# Altium project AUPSC.PrjPcb
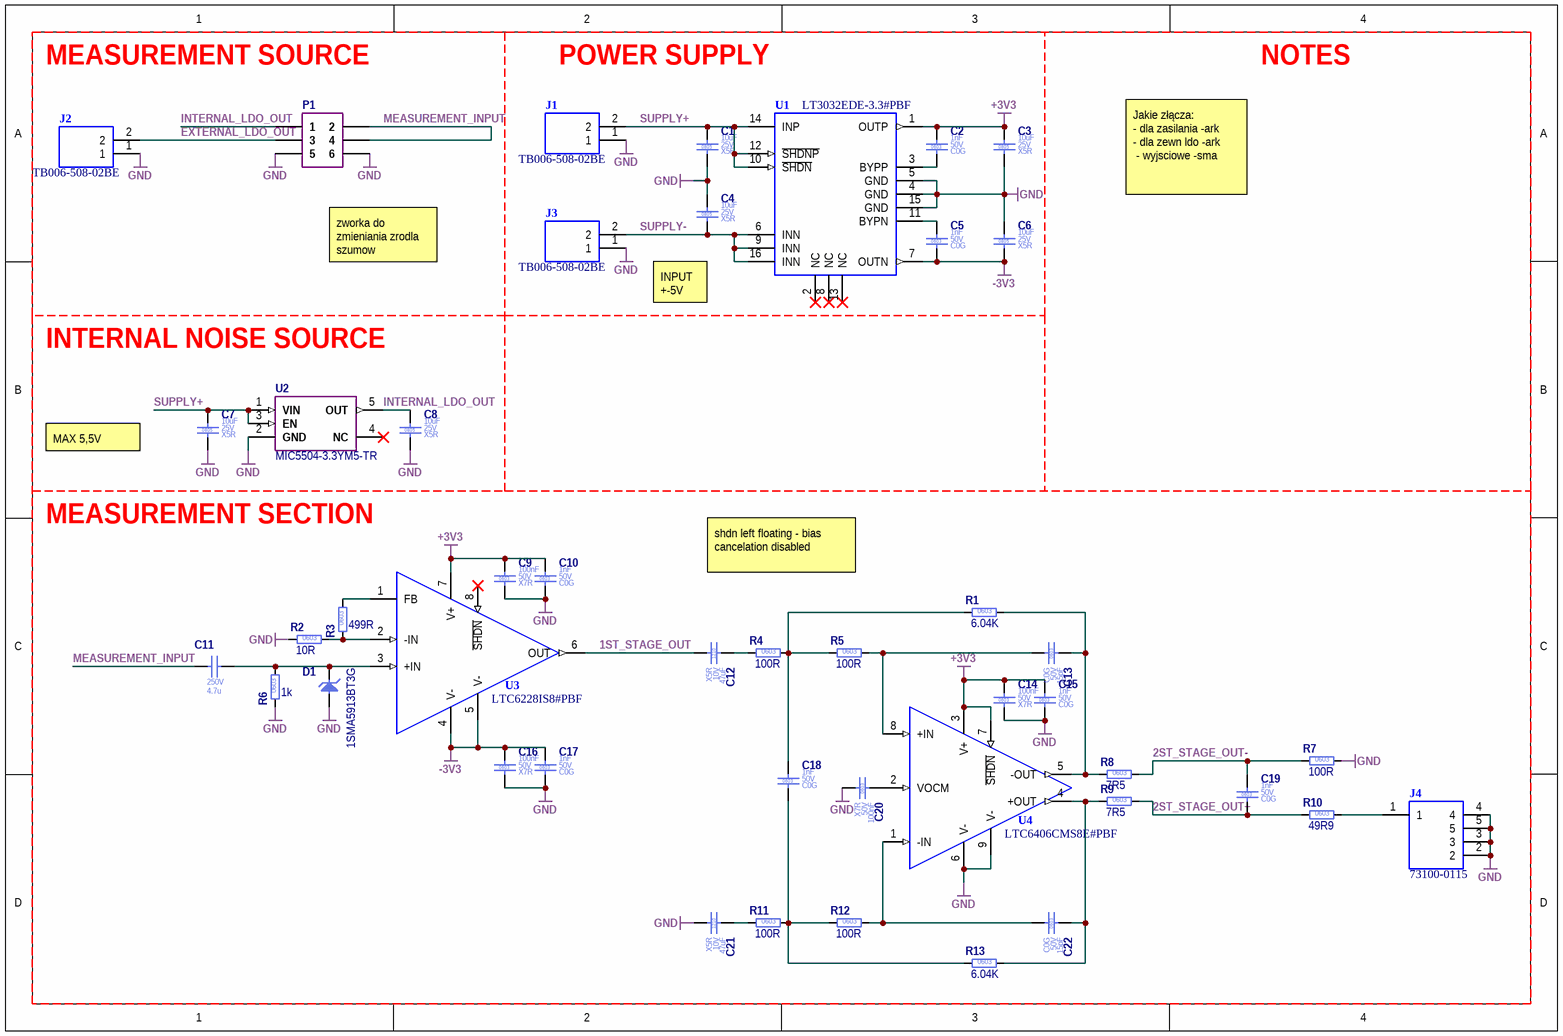
[diagram p0: main.SchDoc]
1 sheet, 45 parts. Net scope: global (net labels, ports and power ports of the same name join across sheets).
Board file: main.PcbDoc

## Sheet main.SchDoc
size A4; Revision: Rev 0

### Parts
C1  Case/Package: 0805  Voltage Rating (DC): 25V  Dielectric: X5R  Capacitance: 10uF  [C_0805_2012]  (hidden comment: C_10UF_25V_X5R_0805_20)
C2  Case/Package: 0603  Voltage Rating (DC): 50V  Dielectric: C0G  Capacitance: 1nF  [C_0603_1608]  (hidden comment: C_1NF_50V_C0G_0603_5)
C3  Case/Package: 0805  Voltage Rating (DC): 25V  Dielectric: X5R  Capacitance: 10uF  [C_0805_2012]  (hidden comment: C_10UF_25V_X5R_0805_20)
C4  Case/Package: 0805  Voltage Rating (DC): 25V  Dielectric: X5R  Capacitance: 10uF  [C_0805_2012]  (hidden comment: C_10UF_25V_X5R_0805_20)
C5  Case/Package: 0603  Voltage Rating (DC): 50V  Dielectric: C0G  Capacitance: 1nF  [C_0603_1608]  (hidden comment: C_1NF_50V_C0G_0603_5)
C6  Case/Package: 0805  Voltage Rating (DC): 25V  Dielectric: X5R  Capacitance: 10uF  [C_0805_2012]  (hidden comment: C_10UF_25V_X5R_0805_20)
C7  Case/Package: 0805  Voltage Rating (DC): 25V  Dielectric: X5R  Capacitance: 10uF  [C_0805_2012]  (hidden comment: C_10UF_25V_X5R_0805_20)
C8  Case/Package: 0805  Voltage Rating (DC): 25V  Dielectric: X5R  Capacitance: 10uF  [C_0805_2012]  (hidden comment: C_10UF_25V_X5R_0805_20)
C9  Case/Package: 0603  Voltage Rating (DC): 50V  Dielectric: X7R  Capacitance: 100nF  [C_0603_1608]  (hidden comment: C_100NF_50V_X7R_0603_5)
C10  Case/Package: 0603  Voltage Rating (DC): 50V  Dielectric: C0G  Capacitance: 1nF  [C_0603_1608]  (hidden comment: C_1NF_50V_C0G_0603_5)
C11  Voltage Rating (DC): 250V  Capacitance: 4.7u  [CP_22.5mm_tht]  (hidden comment: C)
C12  Case/Package: 1210  Voltage Rating (DC): 10V  Dielectric: X5R  Capacitance: 47uF  [C_1210_3225]  (hidden comment: C_47UF_10V_X5R_1210_10)
C13  Case/Package: 0603  Voltage Rating (DC): 50V  Dielectric: C0G  Capacitance: 15pF  [C_0603_1608]  (hidden comment: C_15PF_50V_C0G_0603_5)
C14  Case/Package: 0603  Voltage Rating (DC): 50V  Dielectric: X7R  Capacitance: 100nF  [C_0603_1608]  (hidden comment: C_100NF_50V_X7R_0603_5)
C15  Case/Package: 0603  Voltage Rating (DC): 50V  Dielectric: C0G  Capacitance: 1nF  [C_0603_1608]  (hidden comment: C_1NF_50V_C0G_0603_5)
C16  Case/Package: 0603  Voltage Rating (DC): 50V  Dielectric: X7R  Capacitance: 100nF  [C_0603_1608]  (hidden comment: C_100NF_50V_X7R_0603_5)
C17  Case/Package: 0603  Voltage Rating (DC): 50V  Dielectric: C0G  Capacitance: 1nF  [C_0603_1608]  (hidden comment: C_1NF_50V_C0G_0603_5)
C18  Case/Package: 0603  Voltage Rating (DC): 50V  Dielectric: C0G  Capacitance: 1nF  [C_0603_1608]  (hidden comment: C_1NF_50V_C0G_0603_5)
C19  Case/Package: 0603  Voltage Rating (DC): 50V  Dielectric: C0G  Capacitance: 1nF  [C_0603_1608]  (hidden comment: C_1NF_50V_C0G_0603_5)
C20  Case/Package: 0603  Voltage Rating (DC): 50V  Dielectric: X7R  Capacitance: 100nF  [C_0603_1608]  (hidden comment: C_100NF_50V_X7R_0603_5)
C21  Case/Package: 1210  Voltage Rating (DC): 10V  Dielectric: X5R  Capacitance: 47uF  [C_1210_3225]  (hidden comment: C_47UF_10V_X5R_1210_10)
C22  Case/Package: 0603  Voltage Rating (DC): 50V  Dielectric: C0G  Capacitance: 15pF  [C_0603_1608]  (hidden comment: C_15PF_50V_C0G_0603_5)
D1  1SMA5913BT3G  [SMA-2]
J1  TB006-508-02BE  [TB00650802BE]
J2  TB006-508-02BE  [TB00650802BE]
J3  TB006-508-02BE  [TB00650802BE]
J4  73100-0115  [731000115]
P1  826925-3  [HEADER_M_2x3_2.54]  (value not drawn)
R1  Resistance: 6.04K  Case/Package: 0603  [R_0603_1608]  (hidden comment: R_6K04_0603_1)
R2  Resistance: 10R  Case/Package: 0603  [R_0603_1608]  (hidden comment: R_10R_0603_1)
R3  Resistance: 499R  Case/Package: 0603  [R_0603_1608]  (hidden comment: R_499R_0603_1)
R4  Resistance: 100R  Case/Package: 0603  [R_0603_1608]  (hidden comment: R_100R_0603_1)
R5  Resistance: 100R  Case/Package: 0603  [R_0603_1608]  (hidden comment: R_100R_0603_1)
R6  Resistance: 1k  Case/Package: 0603  [R_0603_1608]  (hidden comment: R_1K_0603_1)
R7  Resistance: 100R  Case/Package: 0603  [R_0603_1608]  (hidden comment: R_100R_0603_1)
R8  Resistance: 7R5  Case/Package: 0603  [R_0603_1608]  (hidden comment: R_7R5_0603_1)
R9  Resistance: 7R5  Case/Package: 0603  [R_0603_1608]  (hidden comment: R_7R5_0603_1)
R10  Resistance: 49R9  Case/Package: 0603  [R_0603_1608]  (hidden comment: R_49R9_0603_1)
R11  Resistance: 100R  Case/Package: 0603  [R_0603_1608]  (hidden comment: R_100R_0603_1)
R12  Resistance: 100R  Case/Package: 0603  [R_0603_1608]  (hidden comment: R_100R_0603_1)
R13  Resistance: 6.04K  Case/Package: 0603  [R_0603_1608]  (hidden comment: R_6K04_0603_1)
U1  LT3032EDE-3.3#PBF  [LT3032EDE5PBF]
U2  MIC5504-3.3YM5-TR  [SOT23-5_SC74A_SOT753_M]
U3  LTC6228IS8#PBF  [SOIC127P599X175-8N]
U4  LTC6406CMS8E#PBF  [SOP65P490X110-9N]

### Blocks framed on the sheet
INTERNAL NOISE SOURCE: C7 C8 U2

### Nets
+3V3: C2.1 C3.1 C9.1 C10.1 C14.1 C15.1 U1.1(OUTP) U3.7(V+) U4.3(V+) U4.7(~{SHDN})
-3V3: C5.2 C6.2 C16.1 C17.1 U1.7(OUTN) U3.4(V-) U3.5(V-)
GND: C1.2 C3.2 C4.1 C6.1 C7.2 C8.2 C9.2 C10.2 C14.2 C15.2 C16.2 C17.2 C20.2 C21.2 D1.1(A) J1.1 J2.1 J3.1 J4.2 J4.3 J4.4 J4.5 P1.5 P1.6 R2.1 R6.1 R7.2 U1.4(GND) U1.5(GND) U1.15(GND) U2.2(GND) U4.6(V-) U4.9(V-)
1ST_STAGE_OUT: C12.2 U3.6(OUT)
2ST_STAGE_OUT+: C19.2 R9.2 R10.1
2ST_STAGE_OUT-: C19.1 R7.1 R8.2
EXTERNAL_LDO_OUT: J2.2 P1.3
INTERNAL_LDO_OUT: C8.1 P1.1 U2.5(OUT)
MEASUREMENT_INPUT: C11.2 P1.2 P1.4
SUPPLY+: C1.1 C7.1 J1.2 U1.10(~{SHDN}) U1.12(~{SHDNP}) U1.14(INP) U2.1(VIN) U2.3(EN)
SUPPLY-: C4.2 J3.2 U1.6(INN) U1.9(INN) U1.16(INN)
NetC2_2: C2.2 U1.3(BYPP)
NetC5_1: C5.1 U1.11(BYPN)
NetC11_1: C11.1 D1.2(C) R6.2 U3.3(+IN)
NetC12_1: C12.1 R4.1
NetC13_1: C13.1 R1.2 R8.1 U4.5(-OUT)
NetC13_2: C13.2 R5.2 U4.8(+IN)
NetC18_1: C18.1 R1.1 R4.2 R5.1
NetC18_2: C18.2 R11.2 R12.1 R13.1
NetC20_1: C20.1 U4.2(VOCM)
NetC21_1: C21.1 R11.1
NetC22_1: C22.1 R9.1 R13.2 U4.4(+OUT)
NetC22_2: C22.2 R12.2 U4.1(-IN)
NetJ4_1: J4.1 R10.2
NetR2_2: R2.2 R3.1 U3.2(-IN)
NetR3_2: R3.2 U3.1(FB)

Not connected (* = marked no-connect by the designer): U1 2(NC)* 8(NC)* 13(NC)*; U2 4(NC)*; U3 8(~{SHDN})*

### Notes on the sheet
- MEASUREMENT SOURCE
- POWER SUPPLY
- NOTES
- Jakie złącza:
  - dla zasilania -ark
  - dla zewn ldo -ark
  - wyjsciowe -sma
- zworka do zmieniania zrodla szumow
- INPUT +-5V
- MAX 5,5V
- MEASUREMENT SECTION
- shdn left floating - bias cancelation disabled
- Title
- Size:
- Date:
- A4

### Library data of the parts
C1 C3 C4 C6-C8 = C_10UF_25V_X5R_0805_20: Ceramic Capacitor; Manufacturer Part Number: TMK212BBJ106MG-T; Manufacturer: Taiyo Yuden; Tolerance: 20%; Part Number: C_10UF_25V_X5R_0805_20; Mount: Surface Mount; Height: 1.25mm; HelpURL: https://pl.mouser.com/datasheet/2/396/mlcc02_e-1307760.pdf; RoHS: Compliant; Max Operating Temperature: 85; Status: MK; Supplier 1: Mouser; Supplier Part Number 1: 963-TMK212BBJ106MG-T
C2 C5 C10 C15 C17-C19 = C_1NF_50V_C0G_0603_5: Ceramic Capacitor; Tolerance: 10%; Part Number: C_1NF_50V_C0G_0603_5; Mount: Surface Mount; Height: 0mm
C9 C14 C16 C20 = C_100NF_50V_X7R_0603_5: Ceramic Capacitor; Manufacturer Part Number: CC0603JRX7R9BB104; Manufacturer: Yageo; Tolerance: 5%; Part Number: C_100NF_50V_X7R_0603_5; Mount: Surface Mount; Height: 0mm; HelpURL: http://datasheet.octopart.com/CC0603JRX7R9BB104-Yageo-datasheet-10883670.pdf; Max Operating Temperature: 125
C11 = CP_4U7_250V_22.5mm_10: Film Capacitors 250VDC 4.7uF 10% MPET L/S=22.5mm
C12 C21 = C_47UF_10V_X5R_1210_10: Ceramic Capacitor; Tolerance: 10%; Part Number: C_47UF_10V_X5R_1210_10; Mount: Surface Mount; Height: 2.5mm; Max Operating Temperature: 85
C13 C22 = C_15PF_50V_C0G_0603_5: Ceramic Capacitor; Tolerance: 10%; Part Number: C_15PF_50V_C0G_0603_5; Mount: Surface Mount; Height: 0mm
D1 = 1SMA5913BT3G: Zener Diodes 3.3V 1.5W
J1-J3 = TB006-508-02BE: Fixed Terminal Blocks Terminal block, screw type, 5.08 , horizontal, 2 poles, CUI Blue, slotted screw, PCB mount; Manufacturer_Name: CUI Devices; Datasheet Link: https://www.mouser.com/datasheet/2/670/tb006-508-1550645.pdf; Height: 10.4mm; Manufacturer_Part_Number: TB006-508-02BE; Arrow Part Number: TB006-508-02BE; Arrow Price/Stock: https://www.arrow.com/en/products/tb006-508-02be/cui-devices; Mouser Part Number: 490-TB006-508-02BE; Mouser Price/Stock: https://www.mouser.co.uk/ProductDetail/CUI-Devices/TB006-508-02BE?qs=vLWxofP3U2wEdOVV%2FaT04w%3D%3D
J4 = 73100-0115: SMA right angle connector female; Manufacturer_Name: Molex; Datasheet Link: https://www.molex.com/pdm_docs/sd/731000115_sd.pdf; Height: 9.57mm; Manufacturer_Part_Number: 73100-0115; Mouser Part Number: 538-73100-0115; Mouser Price/Stock: https://www.mouser.co.uk/ProductDetail/Molex/73100-0115?qs=dxVETAvtHz69wpck%252B7ItSw%3D%3D
P1 = 826925-3: Header, 3-Pin, Dual row; Manufacturer: TE Connectivity; Gender: Male; Pitch: 2.54mm; Part Number: 826925-3; Manufacturer Part Number: 826925-3; Mount: Through Hole; Number of Rows: 2; Orientation: Straight; HelpURL: https://octopart.com/datasheet/826925-3-te+connectivity-41192668; Max Operating Temperature: 0°C; Number of Pins: 6
R1 R13 = R_6K04_0603_1: Thin Film Resistor; Manufacturer: Yageo; Manufacturer Part Number: RT0603FRE076K04L; Tolerance: 1%; Voltage Rating (DC): 50V; Power Rating: 100mW; Stats: MK; Part Number: R_6K04_0603_1; Mount: Surface Mount; Height: 0.3mm; HelpURL: https://pl.mouser.com/datasheet/2/447/PYu-RT_1-to-0.01_RoHS_L_11-1669912.pdf; RoHS: Compliant; Max Operating Temperature: 155; Supplier 1: Mouser; Supplier Part Number 1: 603-RT0402BRD076K04L; Stock: 0
R2 = R_10R_0603_1: Tolerance: 1%; Voltage Rating (DC): 50V; Power Rating: 100mW; Part Number: R_10R_0603_1; Mount: Surface Mount; Height: 0.45mm; Max Operating Temperature: 155°C
R3 = R_499R_0603_1: Thin Film Resistors; Manufacturer: Yageo; Manufacturer Part Number: RT0603FRE07499RL; Tolerance: 1%; Voltage Rating (DC): 50V; Power Rating: 100mW; Stats: MK; Part Number: R_499R_0603_1; Mount: Surface Mount; Height: 0.45mm; HelpURL: https://pl.mouser.com/datasheet/2/447/PYu-RT_1-to-0.01_RoHS_L_11-1669912.pdf; RoHS: Compliant; Max Operating Temperature: 155; Supplier 1: Mouser; Supplier Part Number 1: 603-RT0402BRD07499RL
R4 R5 R7 R11 R12 = R_100R_0603_1: Tolerance: 1%; Voltage Rating (DC): 50V; Power Rating: 125mW; Part Number: R_100R_0603_1; Mount: Surface Mount; Height: 0.45mm; Max Operating Temperature: 0°C
R6 = R_1K_0603_1: Tolerance: 1%; Power Rating: 100mW; Part Number: R_1K_0603_1; Mount: Surface Mount; Height: 0.45mm; Max Operating Temperature: 0°C
R8 R9 = R_7R5_0603_1: Thin Film Resistor; Manufacturer: Yageo; Manufacturer Part Number: RT0603FRE077R5L; Tolerance: 1%; Voltage Rating (DC): 50V; Power Rating: 100mW; Stats: MK; Part Number: R_7R5_0603_1; Mount: Surface Mount; Height: 0.45mm; HelpURL: https://pl.mouser.com/datasheet/2/447/PYu-RC_Group_51_RoHS_L_10-1664068.pdf; RoHS: Compliant; Max Operating Temperature: 155°C; Supplier 1: Mouser; Supplier Part Number 1: 603-RT0603FRE077R5L
R10 = R_49R9_0603_1: Thin Film Resistors; Manufacturer: Yageo; Manufacturer Part Number: RT0603FRE0749R9L; Tolerance: 1%; Voltage Rating (DC): 50V; Power Rating: 100mW; Stats: MK; Part Number: R_49R9_0603_1; Mount: Surface Mount; Height: 0.45mm; HelpURL: https://pl.mouser.com/datasheet/2/447/PYu-RT_1-to-0.01_RoHS_L_11-1669912.pdf; RoHS: Compliant; Max Operating Temperature: 155°C; Supplier 1: Mouser; Supplier Part Number 1: 603-RT0603FRE0749R9L
U1 = LT3032EDE-5#PBF: LDO Voltage Regulators Dual 200mA Positive/Negative, Low Noise, Low Dropout Linear Regulator / RoHS Compliant; Manufacturer_Name: Analog Devices; Datasheet Link: https://www.arrow.com/en/products/lt3032ede-5pbf/analog-devices; Height: 0.8mm; Manufacturer_Part_Number: LT3032EDE-3.3#PBF; Arrow Part Number: LT3032EDE-3.3#PBF; Arrow Price/Stock: https://www.arrow.com/en/products/lt3032ede-5pbf/analog-devices; Mouser Part Number: 584-LT3032EDE-3.3PBF; Mouser Price/Stock: https://www.mouser.co.uk/ProductDetail/Analog-Devices/LT3032EDE-5PBF?qs=ytflclh7QUXSJKCH531bKg%3D%3D
U2 = MIC5504-3.3YM5-TR: LDO Voltage Regulators Single 300mA LDO; Manufacturer: Microchip; Max Power Dissipation: 660mW; Nominal Output Voltage: 3.3V; Polarity: Positive; Output Type: Fixed; Accuracy: 0,02; Dropout Voltage: 160mV; Max Input Voltage: 5.5V; Min Input Voltage: 3.7V; Min Output Voltage: 3.2V; Quiescent Current: 38µA; Manufacturer Part Number: MIC5504-3.3YM5-TR; Part Number: MIC5504-3.3YM5-TR; Max Output Current: 300mA; Mount: Surface Mount; Case/Package: SOT23-5; Height: 1.45mm; HelpURL: https://pl.mouser.com/datasheet/2/268/MIC550X-1082389.pdf; Max Operating Temperature: 125°C; Max Output Voltage: 3.3V; Number of Pins: 5; RoHS: Compliant; Status: TC; Supplier 1: Mouser; Supplier Part Number 1: 998-MIC5504-3.3YM5TR
U3 = LTC6228IS8#PBF: High Speed Operational Amplifiers Precision Low Drift & Noise HiSpeed; Manufacturer_Name: Analog Devices; Datasheet Link: https://www.analog.com/media/en/technical-documentation/data-sheets/LTC6228-6229.pdf; Height: 1.752mm; Manufacturer_Part_Number: LTC6228IS8#PBF; Arrow Part Number: LTC6228IS8#PBF; Arrow Price/Stock: https://www.arrow.com/en/products/ltc6228is8pbf/analog-devices; Mouser Part Number: 584-LTC6228IS8#PBF; Mouser Price/Stock: https://www.mouser.co.uk/ProductDetail/Analog-Devices/LTC6228IS8PBF?qs=vLWxofP3U2wRr189Jtjlaw%3D%3D
U4 = LTC6406CMS8E#PBF: High Speed Operational Amplifiers 800 MHz, Low Noise, Rail to Rail Input Differential Amplifier/Driver; Manufacturer_Name: Analog Devices; Datasheet Link: https://www.mouser.com/ProductDetail/Analog-Devices/LTC6406CMS8EPBF?qs=hVkxg5c3xu8Lz%2FyrMffn3w%3D%3D; Height: 1.1mm; Manufacturer_Part_Number: LTC6406CMS8E#PBF; Arrow Part Number: LTC6406CMS8E#PBF; Arrow Price/Stock: https://www.arrow.com/en/products/ltc6406cms8epbf/analog-devices; Mouser Part Number: 584-LTC6406CMS8E#PBF; Mouser Price/Stock: https://www.mouser.com/Search/Refine.aspx?Keyword=584-LTC6406CMS8E%23PBF